# Altium schematic sheet TopSheet.SchDoc
size A4; CompanyName: Technische Hochschule Nürnberg Georg Simon Ohm; Organization: UltraZohm; Address1: Kesslerplatz 12; Address2: 90489 Nürnberg; Address3: GERMANY; DocumentNumber: 2; SheetNumber: 1; SheetTotal: 4; Website: www.ultrazohm.com
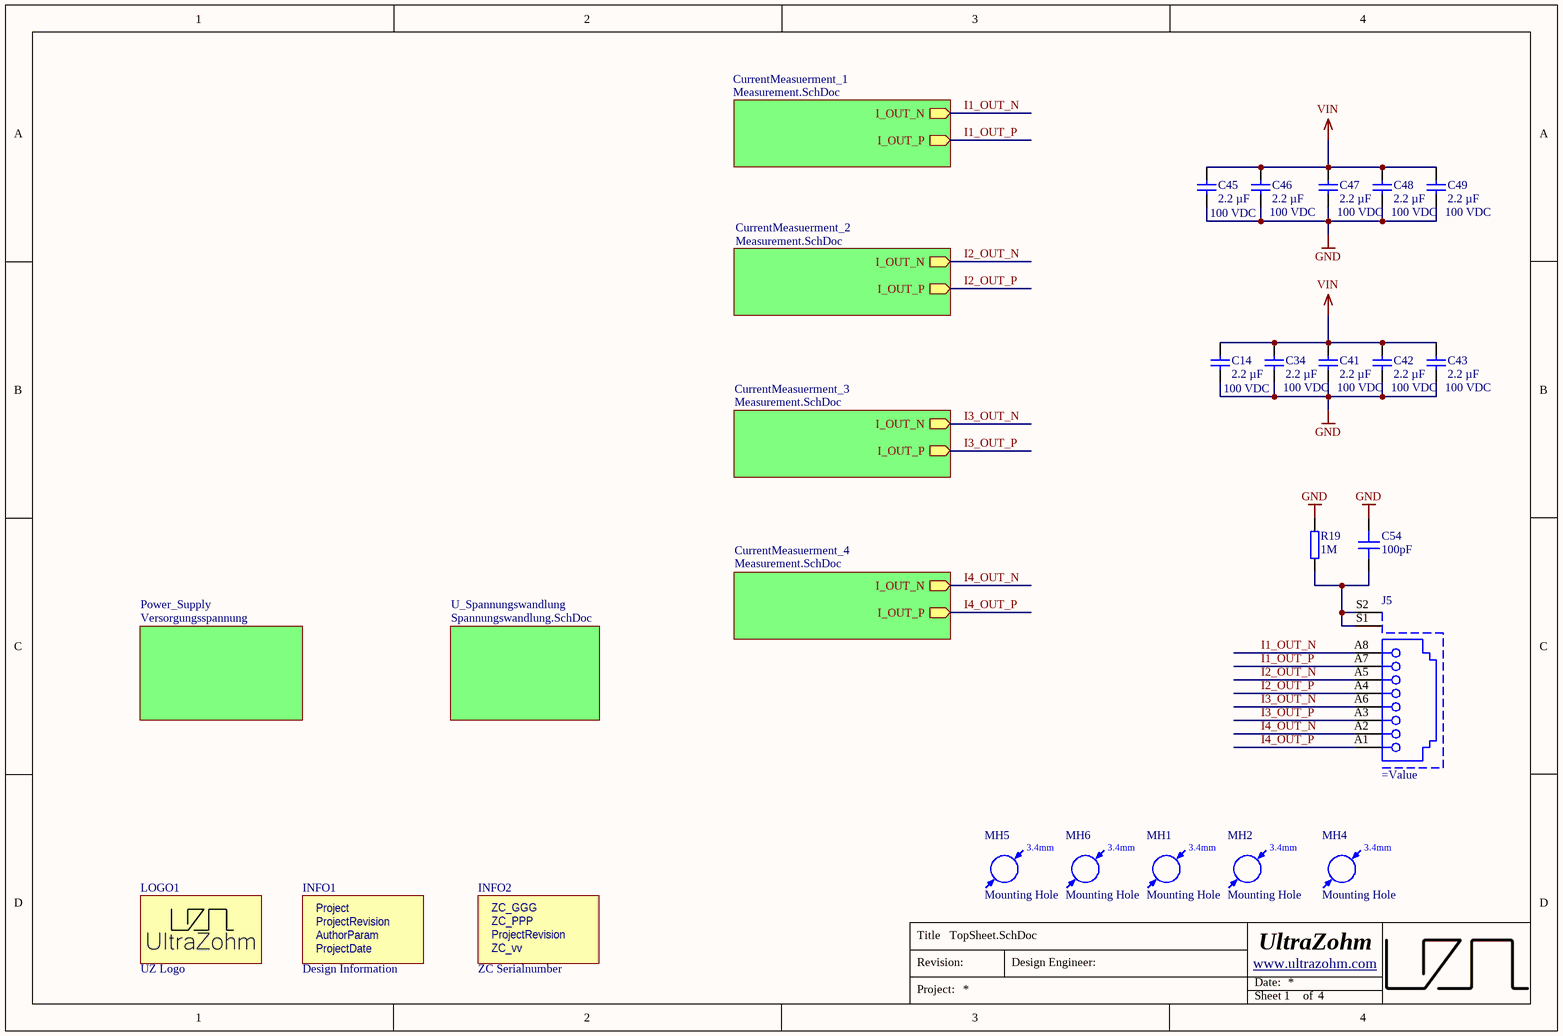
[diagram p0: TopSheet.SchDoc]

## Parts
C14  2.2 µF  Voltage Rating: 100 VDC  [C_1210_TE]
C34  2.2 µF  Voltage Rating: 100 VDC  [C_1210_TE]
C41  2.2 µF  Voltage Rating: 100 VDC  [C_1210_TE]
C42  2.2 µF  Voltage Rating: 100 VDC  [C_1210_TE]
C43  2.2 µF  Voltage Rating: 100 VDC  [C_1210_TE]
C45  2.2 µF  Voltage Rating: 100 VDC  [C_1210_TE]
C46  2.2 µF  Voltage Rating: 100 VDC  [C_1210_TE]
C47  2.2 µF  Voltage Rating: 100 VDC  [C_1210_TE]
C48  2.2 µF  Voltage Rating: 100 VDC  [C_1210_TE]
C49  2.2 µF  Voltage Rating: 100 VDC  [C_1210_TE]
C54  100pF  [C_1206_TE]
INFO1  Design Information  [Design_info]  (no BOM)
INFO2  ZC Serialnumber  [ZC-Serial]  (no BOM)
J5  (no value)  [R-RJ45R10P-B000]
LOGO1  UZ Logo  [UZ_Logo_small]  (no BOM)
MH1  Mounting Hole  [MH_3.4]  (no BOM)
MH2  Mounting Hole  [MH_3.4]  (no BOM)
MH4  Mounting Hole  [MH_3.4]  (no BOM)
MH5  Mounting Hole  [MH_3.4]  (no BOM)
MH6  Mounting Hole  [MH_3.4]  (no BOM)
R19  1M  [RES 0603_1608]

## Sub-sheets
CurrentMeasuerment_1 = Measurement.SchDoc: I_OUT_P (out), I_OUT_N (out)
CurrentMeasuerment_2 = Measurement.SchDoc: I_OUT_P (out), I_OUT_N (out)
CurrentMeasuerment_3 = Measurement.SchDoc: I_OUT_P (out), I_OUT_N (out)
CurrentMeasuerment_4 = Measurement.SchDoc: I_OUT_P (out), I_OUT_N (out)
Power_Supply = Versorgungsspannung: no entries
U_Spannungswandlung = Spannungswandlung.SchDoc: no entries

## Nets
GND: C14.2 C34.2 C41.2 C42.2 C43.2 C45.2 C46.2 C47.2 C48.2 C49.2 C54.2 R19.2
VIN: C14.1 C34.1 C41.1 C42.1 C43.1 C45.1 C46.1 C47.1 C48.1 C49.1
I1_OUT_N: J5.A8 ; sheet CurrentMeasuerment_1/I_OUT_N
I1_OUT_P: J5.A7 ; sheet CurrentMeasuerment_1/I_OUT_P
I2_OUT_N: J5.A5 ; sheet CurrentMeasuerment_2/I_OUT_N
I2_OUT_P: J5.A4 ; sheet CurrentMeasuerment_2/I_OUT_P
I3_OUT_N: J5.A6 ; sheet CurrentMeasuerment_3/I_OUT_N
I3_OUT_P: J5.A3 ; sheet CurrentMeasuerment_3/I_OUT_P
I4_OUT_N: J5.A2 ; sheet CurrentMeasuerment_4/I_OUT_N
I4_OUT_P: J5.A1 ; sheet CurrentMeasuerment_4/I_OUT_P
NetC54_1: C54.1 J5.S1 J5.S2 R19.1

## Notes on the sheet
- Title
- Revision:
- Design Engineer:
- Date:
- Project:
- Sheet
- of
- (in symbol Design Information) Project; ProjectRevision; AuthorParam; ProjectDate
- (in symbol Mounting Hole) 3.4mm
- (in symbol ZC-Serial) ZC_GGG; ZC_PPP; ProjectRevision; ZC_vv

## Library data of the parts
C14 C34 C41-C43 C45-C49 = FS32X225K101EGG: 100V 2.2uF X7R ±10% 1210 Multilayer Ceramic Capacitors MLCC - SMD/SMT ROHS; Manufacturer: PSA(Prosperity Dielectrics); Created from: AGeiger; Manufacturer Part Number: FS32X225K101EGG; PartID: 170; Created On: 11.03.2025 16:22:30; ComponentLink1Description: Datasheet; ComponentLink1URL: https://www.lcsc.com/datasheet/lcsc_datasheet_2410121308_PSA-Prosperity-Dielectrics-FS32X225K101EGG_C153036.pdf; Component Type: Capacitor 1210; Device Package: 1210; Last Updated: 27.05.2025 19:11:48; Mounting Type: SMD; Operating Temperature: -55 to +125°C; Series: FS; Supplier 1: LCSC; Supplier Part Number 1: C153036; Type: Capacitor; Tolerance: 10%; Value: 2.2 µF; Live Cycle Status: 1; LCSC Part Number: C153036
C54 = 1206CG101J102NT: 100pF 1kV C0G ±5% 1206 Multilayer Ceramic Capacitors MLCC - SMD/SMT ROHS; Manufacturer: FH (Guangdong Fenghua Advanced Tech); Created from: TGaupp; Manufacturer Part Number: 1206CG101J102NT; PartID: 514; Created On: 07/10/2026 14:40:40; ComponentLink1Description: Datasheet; ComponentLink1URL: https://jlcpcb.com/partdetail/9713-1206CG101J102NT/C9188; Component Type: Capacitor 1206; Device Package: 1206; Last Updated: 07/10/2026 14:40:40; Mounting Type: SMD; Operating Temperature: -55 to +125°C; Series: C0G; Supplier 1: JLCPCB; Supplier Part Number 1: C9188; Type: Capacitor; Tolerance: 5 %; Voltage Rating: 1kV; Value: 100pF; Live Cycle Status: 1; LCSC Part Number: C9188; Stock number: not stored
INFO1 = Design Information: Manufacturer: UltraZohm; Created from: MGremer; Manufacturer Part Number: Design Information; PartID: 12; Created On: 03/11/2021 09:04:23; ComponentLink1Description: https://docs.ultrazohm.com/; ComponentLink1URL: homepage; Component Type: Design Information; Last Updated: 15/04/2025 09:29:36; Supplier 1: -; Supplier Part Number 1: -; Type: Design Information; Value: Design Information; Live Cycle Status: 1
INFO2 = ZC-Serial: Manufacturer: UltraZohm; Value: GGG-PPP-VVvv; Created from: FRosner; Manufacturer Part Number: ZC-Serial; PartID: 58; Created On: 15/04/2025 09:17:14; ComponentLink1Description: https://docs.ultrazohm.com/; ComponentLink1URL: homepage; Component Type: ZC Serialnumber; Last Updated: 15/04/2025 09:17:14; Supplier 1: -; Supplier Part Number 1: -; Type: Serial Number; Live Cycle Status: 1
J5 = R-RJ45R10P-B000: RJ45Receptacle 1 Shielded Bend insert Without LED 0℃~+70℃ Plugin Ethernet Connectors / Modular Connectors (RJ45 RJ11) ROHS; Manufacturer: Ckmtw(Shenzhen Cankemeng); Created from: KIlhan; Manufacturer Part Number: R-RJ45R10P-B000; PartID: 57; Created On: 20/03/2025 09:19:07; ComponentLink1Description: Datasheet; ComponentLink1URL: https://jlcpcb.com/api/file/downloadByFileSystemAccessId/8588892085580021760; Last Updated: 20/03/2025 13:46:21; Mounting Type: THT; Operating Temperature: 0℃~+70℃; Series: RJ45; Supplier 1: LCSC; Supplier Part Number 1: C386758; Value: R-RJ45R10P-B000; LCSC Part Number: C386758
LOGO1 = Logo small: Manufacturer: UltraZohm; Created from: MGremer; Created: Jan2021_Liegmann; Value: Logo; Manufacturer Part Number: Logo small; PartID: 10; Created On: 03.11.2021 09:04:23; ComponentLink1Description: https://docs.ultrazohm.com/; ComponentLink1URL: homepage; Component Type: Logo; Last Updated: 03.11.2021 09:05:50; Supplier 1: -; Supplier Part Number 1: -; Type: Logo; Live Cycle Status: 1
MH1 MH2 MH4-MH6 = Mounting Hole: Created from: MHlatky; Manufacturer Part Number: Mounting Hole; PartID: 16; Created On: 26.01.2021 09:19:51; ComponentLink1Description: Datasheet; Component Type: Mounting Hole; Device Package: -; Last Updated: 21.03.2022 23:05:12; Manufacturer: Mounting Hole; Supplier 1: Mounting Hole; Supplier Part Number 1: Mounting Hole; Type: Mounting Hole; Value: Mounting Hole; Live Cycle Status: 1; Stock number: not stored
R19 = CRCW06031M00FKEAC: SMD resistor 1%; Manufacturer: Vishay / Dale; Created from: MGremer; Manufacturer Part Number: CRCW06031M00FKEAC; PartID: 179; Created On: 14/12/2020 16:17:14; ComponentLink1Description: Datasheet; ComponentLink1URL: https://www.mouser.de/datasheet/2/427/crcwce3-1762584.pdf; Component Type: SMD resistor; Device Package: 0603; Last Updated: 07/10/2026 14:27:53; Mounting Type: SMD; Supplier 1: Mouser; Supplier Part Number 1: 71-CRCW06031M00FKEAC; Type: Resistor; Tolerance: 1%; Value: 1M; Live Cycle Status: 1; Stock number: not stored; LCSC Part Number: C844537